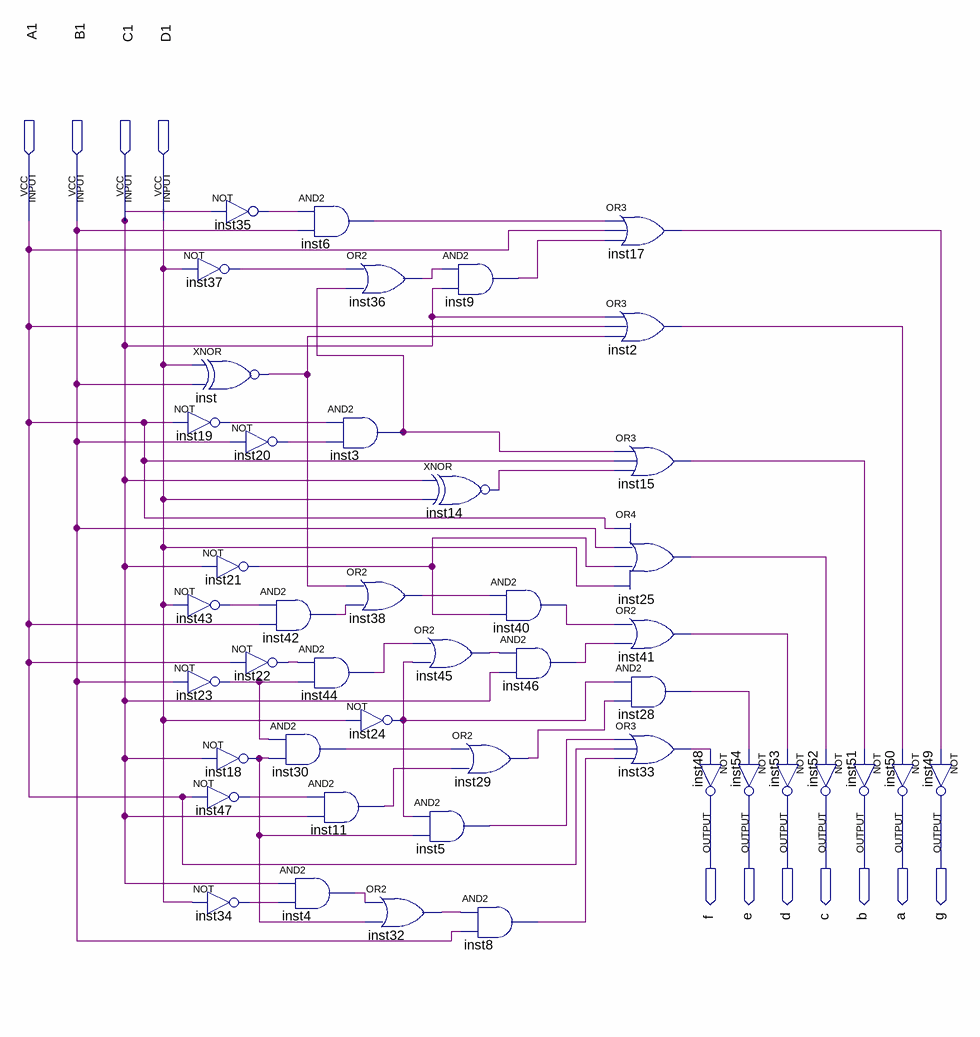
[diagram p0: schematic sheet]
// Quartus schematic Display7seg.bdf as structural Verilog: 45 symbols, 11 pins
module Display7seg (
  input  A1,
  input  B1,
  input  C1,
  input  D1,
  output f,
  output e,
  output d,
  output c,
  output b,
  output a,
  output g
);

  wire inst2_out, inst3_out, inst4_out, inst5_out, inst6_out, inst8_out, inst9_out, inst11_out, inst14_out,
       inst15_out, inst17_out, inst18_out, inst19_out, inst20_out, inst21_out, inst22_out, inst23_out,
       inst24_out, inst25_out, inst28_out, inst29_out, inst30_out, inst32_out, inst33_out, inst34_out,
       inst35_out, inst36_out, inst37_out, inst38_out, inst40_out, inst41_out, inst42_out, inst43_out,
       inst44_out, inst45_out, inst46_out, inst47_out, inst_out;

  not inst37 (inst37_out, D1);
  xnor inst (inst_out, D1, B1);
  not inst19 (inst19_out, A1);
  not inst21 (inst21_out, C1);
  not inst43 (inst43_out, D1);
  not inst23 (inst23_out, B1);
  not inst18 (inst18_out, C1);
  not inst47 (inst47_out, A1);
  not inst34 (inst34_out, D1);
  not inst35 (inst35_out, C1);
  not inst20 (inst20_out, B1);
  and inst42 (inst42_out, inst43_out, A1);
  not inst22 (inst22_out, A1);
  and inst30 (inst30_out, inst23_out, inst18_out);
  and inst4 (inst4_out, C1, inst34_out);
  and inst6 (inst6_out, inst35_out, B1);
  or inst36 (inst36_out, inst37_out, inst3_out);
  and inst3 (inst3_out, inst19_out, inst20_out);
  or inst38 (inst38_out, inst_out, inst42_out);
  and inst44 (inst44_out, inst22_out, inst23_out);
  not inst24 (inst24_out, D1);
  and inst11 (inst11_out, inst47_out, C1);
  xnor inst14 (inst14_out, C1, D1);
  or inst45 (inst45_out, inst44_out, inst24_out);
  and inst5 (inst5_out, inst24_out, inst18_out);
  or inst32 (inst32_out, inst4_out, inst18_out);
  and inst9 (inst9_out, inst36_out, C1);
  and inst40 (inst40_out, inst38_out, inst21_out);
  and inst46 (inst46_out, inst45_out, C1);
  or inst29 (inst29_out, inst30_out, inst11_out);
  and inst8 (inst8_out, inst32_out, B1);
  or inst17 (inst17_out, inst6_out, A1, inst9_out);
  or inst2 (inst2_out, C1, A1, inst_out);
  or inst15 (inst15_out, inst3_out, A1, inst14_out);
  or inst25 (inst25_out, A1, B1, inst21_out, D1);
  or inst41 (inst41_out, inst40_out, inst46_out);
  and inst28 (inst28_out, inst24_out, inst29_out);
  or inst33 (inst33_out, inst5_out, A1, inst8_out);
  not inst48 (f, inst33_out);
  not inst54 (e, inst28_out);
  not inst52 (c, inst25_out);
  not inst53 (d, inst41_out);
  not inst50 (a, inst2_out);
  not inst51 (b, inst15_out);
  not inst49 (g, inst17_out);
endmodule
